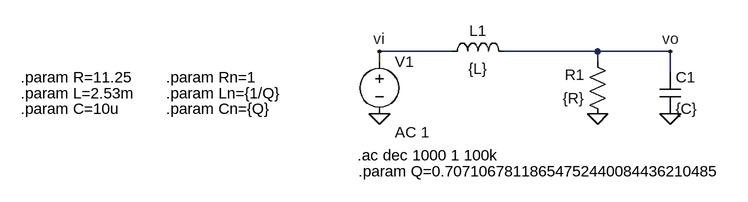
[diagram p0: schematic FiltroButterPasaBajos.asc]
FiltroButterPasaBajos.asc, the LTspice schematic file:
Version 4
SHEET 1 880 680
WIRE -80 80 -192 80
WIRE 144 80 0 80
WIRE 256 80 144 80
WIRE -192 96 -192 80
WIRE 144 96 144 80
WIRE 256 112 256 80
FLAG -192 176 0
FLAG 144 176 0
FLAG 256 176 0
FLAG 256 80 vo
FLAG -192 80 vi
SYMBOL res 160 192 R180
WINDOW 0 36 76 Left 2
WINDOW 3 36 40 Left 2
SYMATTR InstName R1
SYMATTR Value {R}
SYMBOL cap 240 112 R0
SYMATTR InstName C1
SYMATTR Value {C}
SYMBOL ind -96 96 R270
WINDOW 0 32 56 VTop 2
WINDOW 3 5 56 VBottom 2
SYMATTR InstName L1
SYMATTR Value {L}
SYMBOL voltage -192 80 R0
WINDOW 123 24 124 Left 2
WINDOW 39 0 0 Left 0
SYMATTR InstName V1
SYMATTR Value ""
SYMATTR Value2 AC 1
TEXT -226 240 Left 2 !.ac dec 1000 1 100k
TEXT -224 264 Left 2 !.param Q=0.70710678118654752440084436210485
TEXT -744 120 Left 2 !.param R=11.25
TEXT -744 168 Left 2 !.param C=10u
TEXT -744 144 Left 2 !.param L=2.53m
TEXT -520 120 Left 2 !.param Rn=1
TEXT -520 168 Left 2 !.param Cn={Q}
TEXT -520 144 Left 2 !.param Ln={1/Q}

The netlist it stands for:
* FiltroButterPasaBajos.asc
R1 0 vo {R}
C1 vo 0 {C}
L1 vi vo {L}
V1 vi 0 AC 1
.ac dec 1000 1 100k
.param Q=0.70710678118654752440084436210485
.param R=11.25
.param C=10u
.param L=2.53m
.param Rn=1
.param Cn={Q}
.param Ln={1/Q}
.backanno
.end